# Altium schematic sheet MainSheet.SchDoc
size A4; SheetNumber: 1; SheetTotal: 6
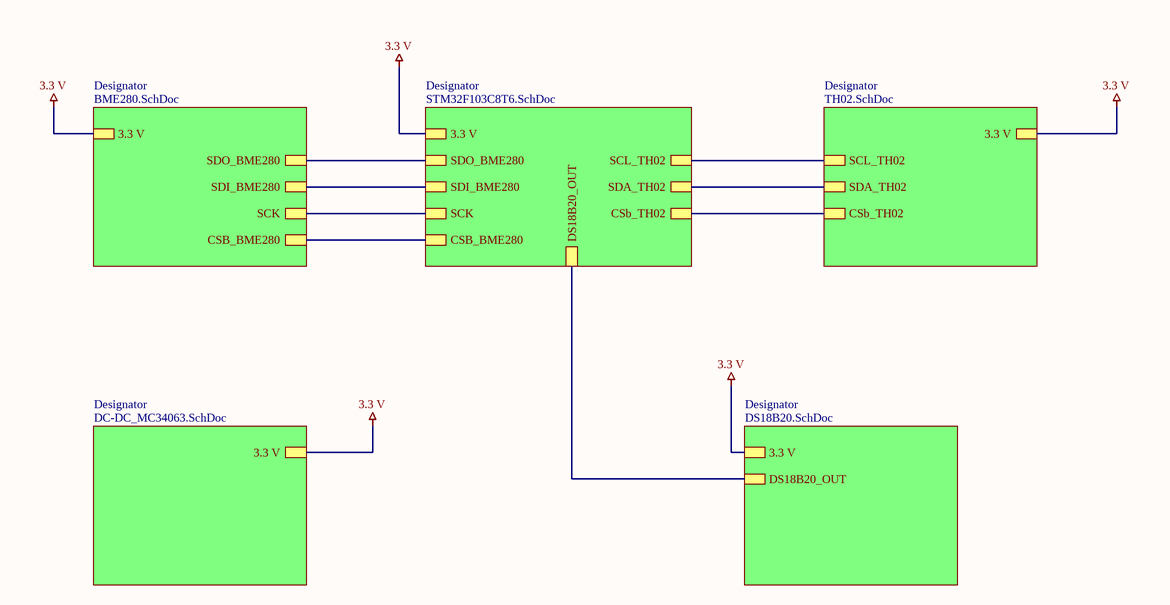
[diagram p0: MainSheet.SchDoc]

## Sub-sheets
Designator = DC-DC_MC34063.SchDoc: 3.3 V
Designator = STM32F103C8T6.SchDoc: 3.3 V, SDO_BME280, SDI_BME280, SCK, CSB_BME280, SCL_TH02, SDA_TH02, CSb_TH02, DS18B20_OUT
Designator = DS18B20.SchDoc: 3.3 V, DS18B20_OUT
Designator = BME280.SchDoc: 3.3 V, SDO_BME280, SDI_BME280, SCK, CSB_BME280
Designator = TH02.SchDoc: 3.3 V, SCL_TH02, SDA_TH02, CSb_TH02

## Nets
3.3 V: sheet Designator/3.3 V, sheet Designator/3.3 V, sheet Designator/3.3 V, sheet Designator/3.3 V, sheet Designator/3.3 V
(unnamed): sheet Designator/SDO_BME280, sheet Designator/SDO_BME280
(unnamed): sheet Designator/SDI_BME280, sheet Designator/SDI_BME280
(unnamed): sheet Designator/SCK, sheet Designator/SCK
(unnamed): sheet Designator/CSB_BME280, sheet Designator/CSB_BME280
(unnamed): sheet Designator/SCL_TH02, sheet Designator/SCL_TH02
(unnamed): sheet Designator/SDA_TH02, sheet Designator/SDA_TH02
(unnamed): sheet Designator/CSb_TH02, sheet Designator/CSb_TH02
(unnamed): sheet Designator/DS18B20_OUT, sheet Designator/DS18B20_OUT